# EAGLE board IBL behavior control (EAGLE 6.5.0)
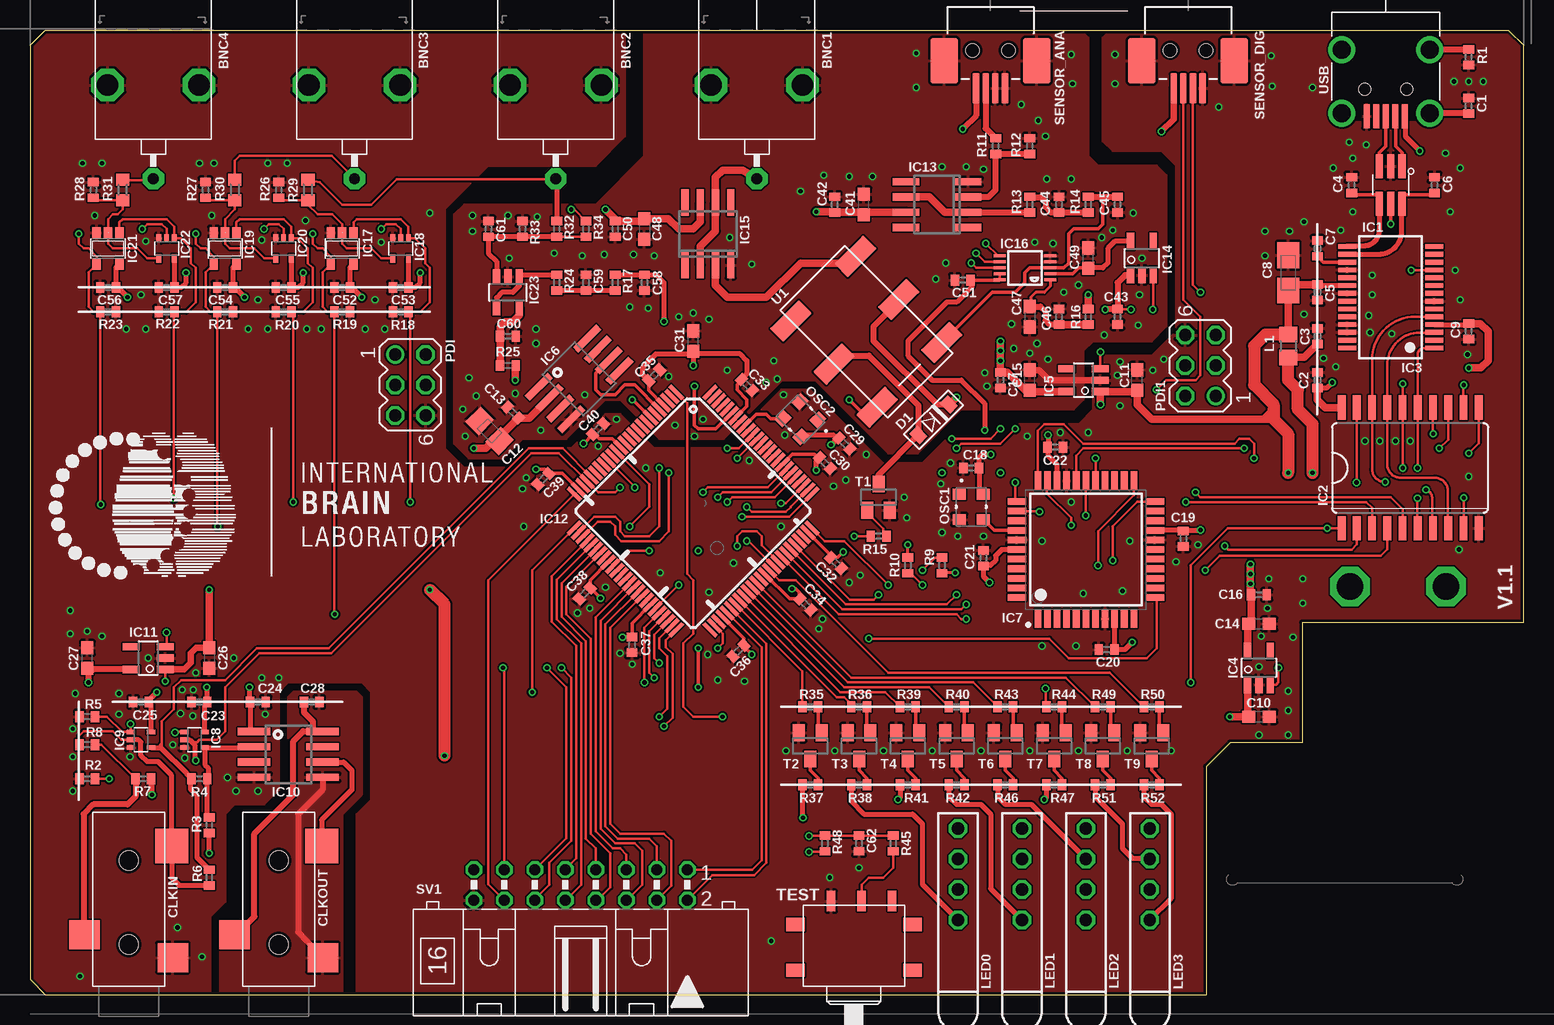
[diagram p2: board, top side]
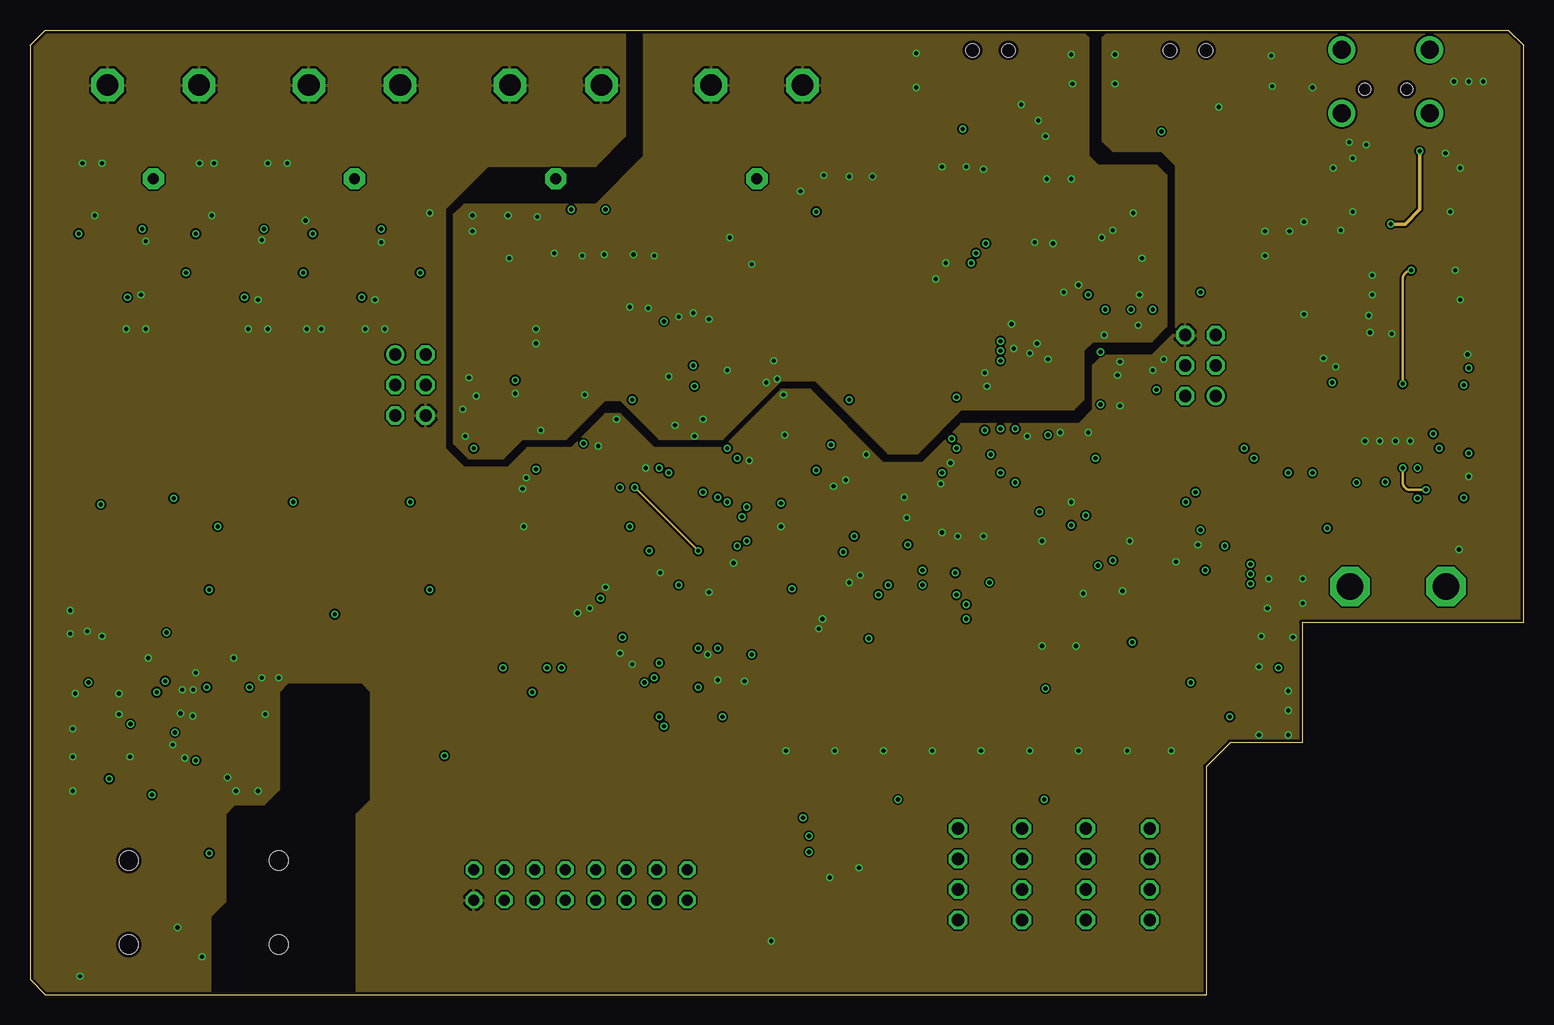
[diagram p3: board, inner layer Ground]
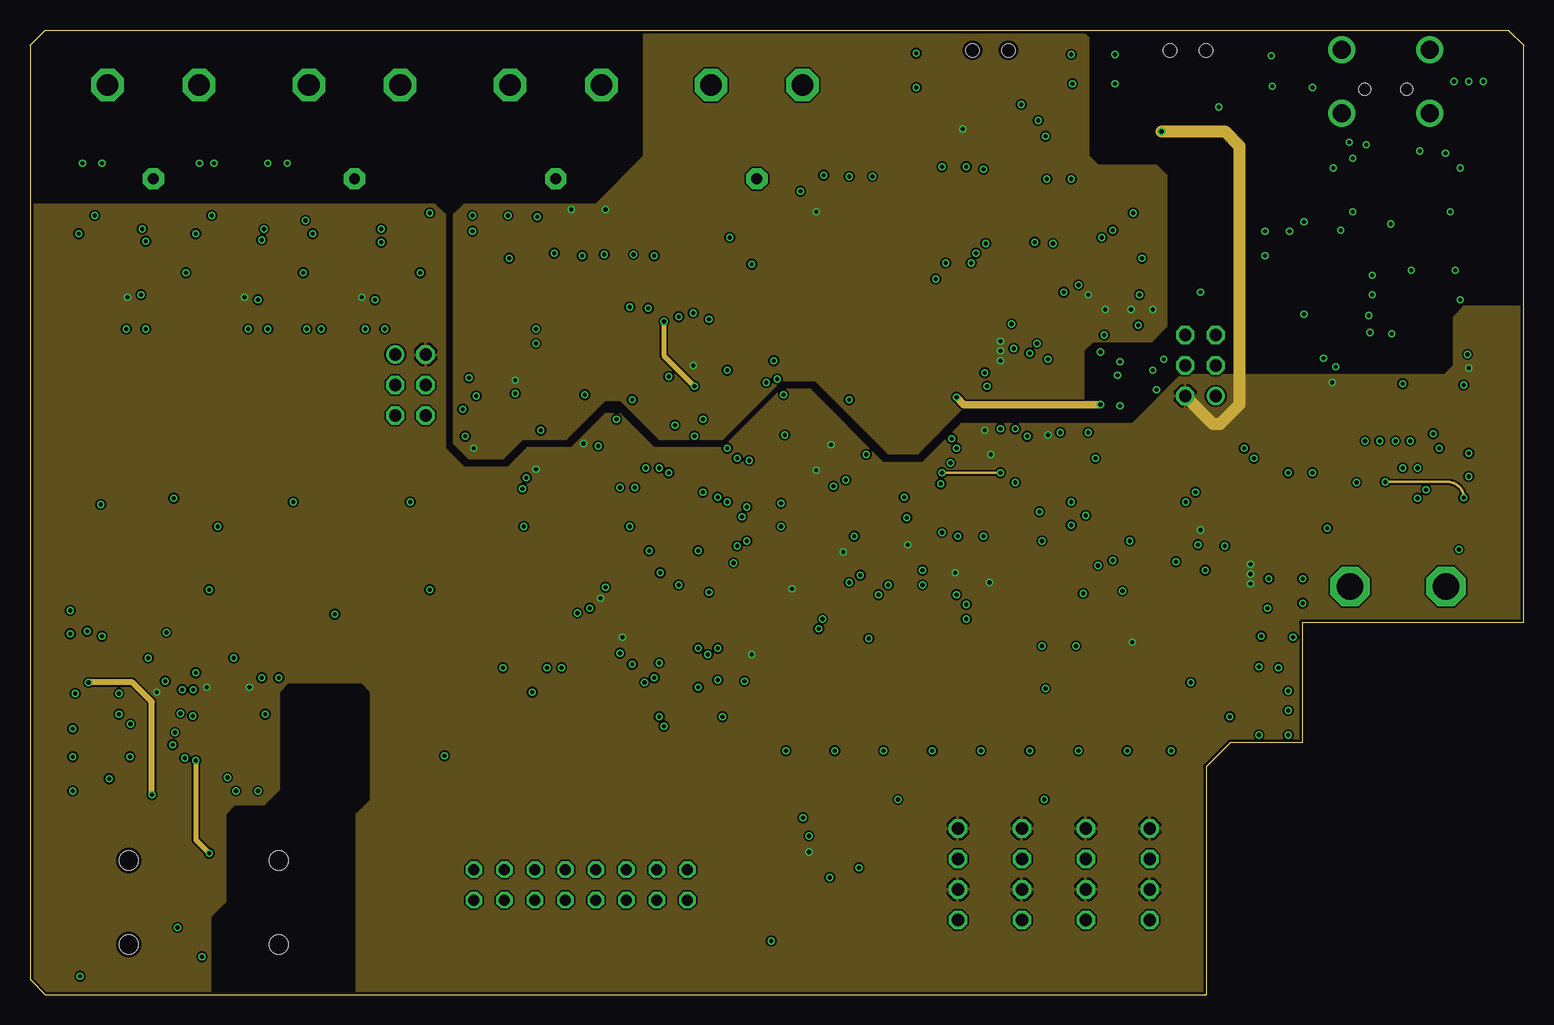
[diagram p4: board, inner layer Power]
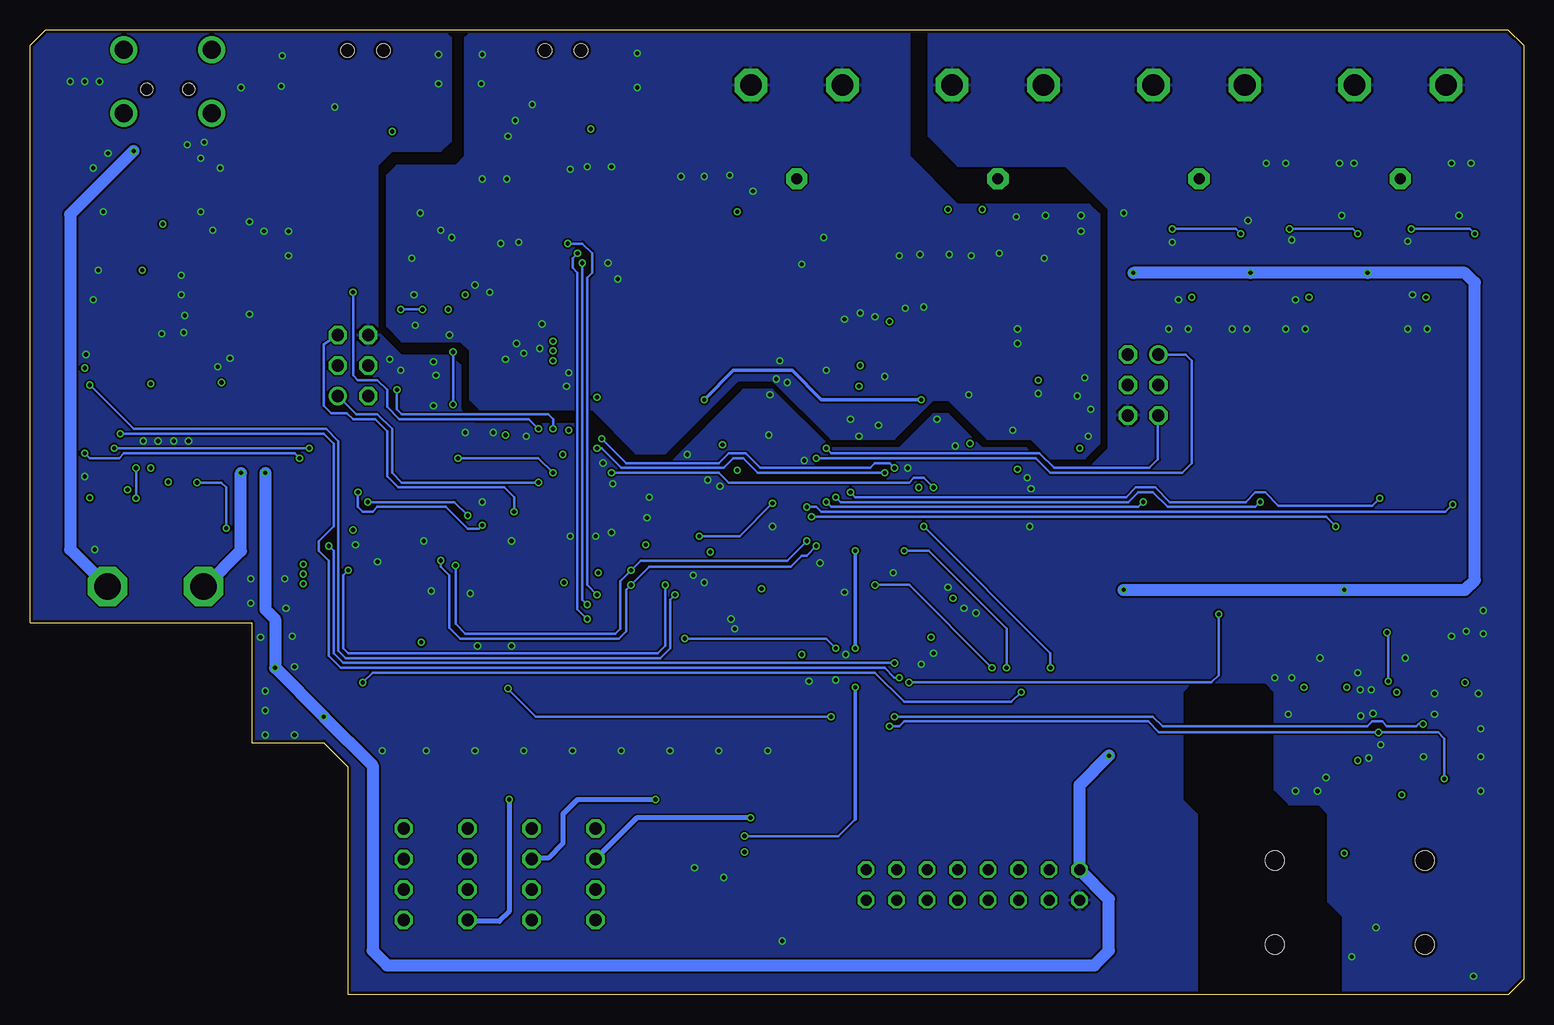
[diagram p5: board, bottom side, seen from below]

Size 124.46 x 80.38 mm. Coordinates in mm from the lower left corner, seen from the top.
Outline: 0,79.11 0,1.27 1.27,0 98,0 98,19 100,21 106,21 106,31 124.46,31 124.46,79.11 123.19,80.38 1.27,80.38 0,79.11
Copper layers (1+2*3+16): Top 0.018mm / dielectric 0.36mm / Ground 0.035mm / dielectric 0.71mm / Power 0.035mm / dielectric 0.36mm / Bottom 0.018mm
Design rules "eC_4Layer_PClass6_BaseCopperO18-I35_eCDefault *": minimum track width 0.15mm, minimum drill 0.35mm, track to track 0.15mm, track to pad 0.15mm, pad to pad 0.15mm, via to via 0.15mm, smd to smd 0mil, copper to edge 0.25mm, drill to drill 0.35mm, minimum pad ring 0.175mm, minimum via ring 0.125mm, stop-mask expansion 0mil, vias tented up to drill 0.45mm, thermal gap 0.2mm
tKeepout: area 0,0.5 to 2.5,80.5; area 122.4,0.5 to 125,80.5
bKeepout: area 122.4,0.5 to 125,80.5

## Footprints (pad centres in the part's own frame; a part is rotated, then mirrored left to right if it is on the bottom)
0731000105 = drill 0.914 pad 1.778 octagon: 1 0,12.395 | drill 1.803 octagon: 2 -3.81,4.597; 3 3.81,4.597
C0402 = smd 0.7 x 0.9: 1 -0.65,0; 2 0.65,0
A/3216-18W = smd 2.15 x 1.8: + 1.475,0; - -1.475,0
C0603 = smd 1.1 x 1: 1 -0.85,0; 2 0.85,0
R/2012-12R = smd 1.55 x 1.8: + 1.175,0; - -1.175,0
35RASMT2BHNTRX = smd 2.4 x 2.55: 1 0.8,3.675; 5 -1.1,-3.675 | smd 2.9 x 2.75: 4 8.2,-3.575 | hole 1.6: 0,0; 7,0
SOD123 = smd 0.914 x 1.219: A -1.8,0; C 1.8,0
SOT23-6L = smd 0.6 x 2: P$1 -0.95,-1.55; P$2 0,-1.55; P$3 0.95,-1.55; P$4 0.95,1.55; P$5 0,1.55; P$6 -0.95,1.55
SO20W = smd 0.66 x 2.032: 1 -5.715,-5.029; 2 -4.445,-5.029; 3 -3.175,-5.029; 4 -1.905,-5.029; 5 -0.635,-5.029; 6 0.635,-5.029; 7 1.905,-5.029; 8 3.175,-5.029; 9 4.445,-5.029; 10 5.715,-5.029; 11 5.715,5.029; 12 4.445,5.029; 13 3.175,5.029; 14 1.905,5.029; 15 0.635,5.029; 16 -0.635,5.029; 17 -1.905,5.029; 18 -3.175,5.029; 19 -4.445,5.029; 20 -5.715,5.029
SSOP28 = smd 0.4 x 1.5: 1 -4.225,-3.625; 2 -3.575,-3.625; 3 -2.925,-3.625; 4 -2.275,-3.625; 5 -1.625,-3.625; 6 -0.975,-3.625; 7 -0.325,-3.625; 8 0.325,-3.625; 9 0.975,-3.625; 10 1.625,-3.625; 11 2.275,-3.625; 12 2.925,-3.625; 13 3.575,-3.625; 14 4.225,-3.625; 15 4.225,3.625; 16 3.575,3.625; 17 2.925,3.625; 18 2.275,3.625; 19 1.625,3.625; 20 0.975,3.625; 21 0.325,3.625; 22 -0.325,3.625; 23 -0.975,3.625; 24 -1.625,3.625; 25 -2.275,3.625; 26 -2.925,3.625; 27 -3.575,3.625; 28 -4.225,3.625
TSOT23-5 = smd 0.6 x 1.408: 1 -0.95,-1.404; 2 0,-1.404; 3 0.95,-1.404; 4 0.95,1.404; 5 -0.95,1.404
SO-08 = smd 0.6 x 2.708: 1 -1.905,-2.854; 2 -0.635,-2.854; 3 0.635,-2.854; 4 1.905,-2.854; 5 1.905,2.854; 6 0.635,2.854; 7 -0.635,2.854; 8 -1.905,2.854
QFP80P1200X1200X120-44N = smd 1.55 x 0.55: 1 -5.75,4; 2 -5.75,3.2; 3 -5.75,2.4; 4 -5.75,1.6; 5 -5.75,0.8; 6 -5.75,0; 7 -5.75,-0.8; 8 -5.75,-1.6; 9 -5.75,-2.4; 10 -5.75,-3.2; 11 -5.75,-4; 23 5.75,-4; 24 5.75,-3.2; 25 5.75,-2.4; 26 5.75,-1.6; 27 5.75,-0.8; 28 5.75,0; 29 5.75,0.8; 30 5.75,1.6; 31 5.75,2.4; 32 5.75,3.2; 33 5.75,4 | smd 0.55 x 1.55: 12 -4,-5.75; 13 -3.2,-5.75; 14 -2.4,-5.75; 15 -1.6,-5.75; 16 -0.8,-5.75; 17 0,-5.75; 18 0.8,-5.75; 19 1.6,-5.75; 20 2.4,-5.75; 21 3.2,-5.75; 22 4,-5.75; 34 4,5.75; 35 3.2,5.75; 36 2.4,5.75; 37 1.6,5.75; 38 0.8,5.75; 39 0,5.75; 40 -0.8,5.75; 41 -1.6,5.75; 42 -2.4,5.75; 43 -3.2,5.75; 44 -4,5.75
SC70-5 = smd 0.4 x 0.7: 1 -0.65,-0.85; 2 0,-0.85; 3 0.65,-0.85; 4 0.65,0.85; 5 -0.65,0.85
TQFP100 = smd 1.5 x 0.35: 1 -8,6; 2 -8,5.5; 3 -8,5; 4 -8,4.5; 5 -8,4; 6 -8,3.5; 7 -8,3; 8 -8,2.5; 9 -8,2; 10 -8,1.5; 11 -8,1; 12 -8,0.5; 13 -8,0; 14 -8,-0.5; 15 -8,-1; 16 -8,-1.5; 17 -8,-2; 18 -8,-2.5; 19 -8,-3; 20 -8,-3.5; 21 -8,-4; 22 -8,-4.5; 23 -8,-5; 24 -8,-5.5; 25 -8,-6; 51 8,-6; 52 8,-5.5; 53 8,-5; 54 8,-4.5; 55 8,-4; 56 8,-3.5; 57 8,-3; 58 8,-2.5; 59 8,-2; 60 8,-1.5; 61 8,-1; 62 8,-0.5; 63 8,0; 64 8,0.5; 65 8,1; 66 8,1.5; 67 8,2; 68 8,2.5; 69 8,3; 70 8,3.5; 71 8,4; 72 8,4.5; 73 8,5; 74 8,5.5; 75 8,6 | smd 0.35 x 1.5: 26 -6,-8; 27 -5.5,-8; 28 -5,-8; 29 -4.5,-8; 30 -4,-8; 31 -3.5,-8; 32 -3,-8; 33 -2.5,-8; 34 -2,-8; 35 -1.5,-8; 36 -1,-8; 37 -0.5,-8; 38 0,-8; 39 0.5,-8; 40 1,-8; 41 1.5,-8; 42 2,-8; 43 2.5,-8; 44 3,-8; 45 3.5,-8; 46 4,-8; 47 4.5,-8; 48 5,-8; 49 5.5,-8; 50 6,-8; 76 6,8; 77 5.5,8; 78 5,8; 79 4.5,8; 80 4,8; 81 3.5,8; 82 3,8; 83 2.5,8; 84 2,8; 85 1.5,8; 86 1,8; 87 0.5,8; 88 0,8; 89 -0.5,8; 90 -1,8; 91 -1.5,8; 92 -2,8; 93 -2.5,8; 94 -3,8; 95 -3.5,8; 96 -4,8; 97 -4.5,8; 98 -5,8; 99 -5.5,8; 100 -6,8
SO8 = smd 0.6 x 2.2: 1 -1.905,-2.6; 2 -0.635,-2.6; 3 0.635,-2.6; 4 1.905,-2.6; 5 1.905,2.6; 6 0.635,2.6; 7 -0.635,2.6; 8 -1.905,2.6
MSOP10 = smd 0.25 x 1: 1 -1,-2.113; 2 -0.5,-2.113; 3 0,-2.113; 4 0.5,-2.113; 5 1,-2.113; 6 1,2.113; 7 0.5,2.113; 8 0,2.113; 9 -0.5,2.113; 10 -1,2.113
SOT23-5 = smd 0.69 x 0.99: 1 -0.95,-1.29; 2 0,-1.29; 3 0.95,-1.29; 4 0.95,1.3; 5 -0.95,1.3
SOT23-5' = smd 0.6 x 1.2: 1 -0.95,-1.306; 2 0,-1.306; 3 0.95,-1.306; 4 0.95,1.306; 5 -0.95,1.306
R0805 = smd 1.3 x 1.5: 1 -0.95,0; 2 0.95,0
569-011X-X00_LED_ARRAY = drill 1.016 octagon: A1 -6.35,0; A2 -1.27,0; C1 -8.89,0; C2 -3.81,0
OSCILLATOR_3.2X2.5 = smd 0.9 x 1.1: P$1 -1.05,-1; P$2 1.05,-1; P$3 1.05,1; P$4 -1.05,1
MA03-2 = drill 1.016: 1 -2.54,-1.27 | drill 1.016 octagon: 2 -2.54,1.27; 3 0,-1.27; 4 0,1.27; 5 2.54,-1.27; 6 2.54,1.27
R0402 = smd 0.7 x 0.9: 1 -0.65,0; 2 0.65,0
R0603 = smd 1 x 1.1: 1 -0.85,0; 2 0.85,0
MQ172X-4PA(31) = smd 0.55 x 2.5: 1 -1.2,6.75; 2 -0.4,6.75; 3 0.4,6.75; 4 1.2,6.75 | smd 2.3 x 3.8: SHIELD1 -3.85,4.45; SHIELD2 3.85,4.45 | hole 1.1: 1.5,3.6; -1.5,3.6
ML16L = drill 0.914 octagon: 1 -8.89,-1.27; 2 -8.89,1.27; 3 -6.35,-1.27; 4 -6.35,1.27; 5 -3.81,-1.27; 6 -3.81,1.27; 7 -1.27,-1.27; 8 -1.27,1.27; 9 1.27,-1.27; 10 1.27,1.27; 11 3.81,-1.27; 12 3.81,1.27; 13 6.35,-1.27; 14 6.35,1.27; 15 8.89,-1.27; 16 8.89,1.27
SOT23 = smd 1 x 1.4: 1 -0.95,-1.1; 2 0.95,-1.1; 3 0,1.1
CFPA = smd 1.7 x 0.7: 1 3.85,1.9; 2 3.85,-0.64; 3 3.85,-3.18 | smd 1.1 x 1.55: NC1 -1.905,4.875; NC2 -1.905,-4.875; NC3 1.905,-4.875; NC4 1.905,4.875
RELAY = smd 1.6 x 3.4: 1 -5.08,-2.54; 3 0,-2.54; 5 5.08,-2.54; 6 5.08,5.08; 8 0,5.08; 10 -5.08,5.08
240-0002-1 = smd 0.5 x 2: P$1 -1.6,8.65; P$2 -0.8,8.65; P$3 0,8.65; P$4 0.8,8.65; P$5 1.6,8.65 | drill 1.5: SHIELD_1 -3.65,3.1; SHIELD_2 3.65,3.1; SHIELD_3 3.65,8.4; SHIELD_4 -3.65,8.4 | hole 1: -1.75,6.4; 1.75,6.4

## Placement (x,y rotation side)
BNC1  [0731000105]  60.57,80.38 180 top
BNC2  [0731000105]  43.81,80.38 180 top
BNC3  [0731000105]  27.04,80.38 180 top
BNC4  [0731000105]  10.28,80.38 180 top
C1  4.7nF  [C0402]  119.89,74.06 90 top
C2  100nF  [C0402]  107.29,51.21 90 top
C3  100nF  [C0402]  107.29,54.86 90 top
C4  47pF  [C0402]  110.13,67.46 90 top
C5  100nF  [C0402]  107.29,58.52 270 top
C6  47pF  [C0402]  117.04,67.46 90 top
C7  100nF  [C0402]  107.29,62.18 90 top
C8  4.7uF  [A/3216-18W]  104.85,60.15 270 top
C9  100nF  [C0402]  119.89,55.27 270 top
C10  4.7uF  [C0603]  102.41,23.16 0 top
C11  10uF  [C0603]  92.25,51.21 90 top
C12  1uF  [R/2012-12R]  38.3,46.98 315 top
C13  100nF  [C0402]  40.24,48.51 135 top
C14  4.7uF  [C0603]  102.41,30.89 0 top
C15  10uF  [C0603]  83.31,51.21 90 top
C16  100nF  [C0402]  102.41,33.32 0 top
C17  100nF  [C0402]  80.87,51.21 270 top
C18  100nF  [C0402]  78.44,43.89 180 top
C19  100nF  [C0402]  96.11,38 270 top
C20  100nF  [C0402]  89.71,28.75 180 top
C21  100nF  [C0402]  79.45,36.37 90 top
C22  100nF  [C0402]  85.45,45.62 0 top
C23  100nF  [C0402]  14.12,24.38 180 top
C24  100nF  [C0402]  19,24.38 0 top
C25  100nF  [C0402]  9.25,24.38 180 top
C26  4.7uF  [C0603]  14.94,28.04 270 top
C27  4.7uF  [C0603]  4.78,28.04 90 top
C28  100nF  [C0402]  23.47,24.38 0 top
C29  100nF  [C0402]  67.87,45.92 315 top
C30  100nF  [C0402]  66.24,44.3 315 top
C31  4.7uF  [C0603]  55.27,54.46 90 top
C32  100nF  [C0402]  67.16,35.97 315 top
C33  100nF  [C0402]  59.74,50.8 315 top
C34  100nF  [C0402]  64.62,32.51 315 top
C35  100nF  [C0402]  52.02,51.61 45 top
C36  100nF  [C0402]  59.03,28.65 225 top
C37  100nF  [C0402]  50.17,29.14 270 top
C38  100nF  [C0402]  46.23,33.43 225 top
C39  100nF  [C0402]  42.77,42.98 225 top
C40  100nF  [C0402]  47.35,47.14 45 top
C41  10uF  [C0603]  69.49,65.84 90 top
C42  100nF  [C0402]  67.06,65.84 90 top
C43  100nF  [C0402]  90.63,56.49 270 top
C44  DNP  [C0402]  85.75,65.84 90 top
C45  DNP  [C0402]  90.63,65.84 270 top
C46  100nF  [C0402]  85.75,56.49 90 top
C47  10uF  [C0603]  83.31,56.49 270 top
C48  10uF  [C0603]  51.21,63.8 270 top
C49  4.7uF  [C0603]  88.19,61.37 90 top
C50  100nF  [C0402]  48.77,63.8 270 top
C51  100nF  [C0402]  77.72,59.54 180 top
C52  100nF  [C0402]  26.01,58.93 180 top
C53  100nF  [C0402]  30.89,58.93 180 top
C54  100nF  [C0402]  16.26,58.93 180 top
C55  100nF  [C0402]  21.13,58.93 180 top
C56  100nF  [C0402]  6.5,58.93 180 top
C57  100nF  [C0402]  11.38,58.93 180 top
C58  DNP  [C0402]  51.21,59.33 90 top
C59  15nF 5%  [C0402]  46.33,59.33 270 top
C60  100nF  [C0402]  39.83,54.86 0 top
C61  DNP  [C0402]  38.2,63.8 270 top
C62  100nF  [C0402]  69.09,12.6 270 top
CLKIN  [35RASMT2BHNTRX]  8.23,4.18 90 top
CLKOUT  [35RASMT2BHNTRX]  20.73,4.18 90 top
D1  1N5819  [SOD123]  75.3,47.91 45 top
IC1  USBLC6-2SC6  [SOT23-6L]  113.39,67.46 180 top
IC2  74AC241DW  [SO20W]  115.01,43.89 0 top
IC3  FT232RL  [SSOP28]  113.39,58.12 90 top
IC4  TLV70033DDCR  [TSOT23-5]  102.41,27.23 0 top
IC5  LP5907MFX-3.3  [TSOT23-5]  87.78,51.21 90 top
IC6  MAX616x  [SO-08]  45.76,51.31 315 top
IC7  ATXMEGAxxxA4U-AU  [QFP80P1200X1200X120-44N]  87.99,37.08 90 top
IC8  [SC70-5]  13.72,21.23 270 top
IC9  [SC70-5]  9.25,21.23 270 top
IC10  SI8610BC-B-IS  [SO-08]  21.54,20.02 270 top
IC11  TLV70033DDCR  [TSOT23-5]  9.86,28.04 90 top
IC12  XMEGA-A1TQFP  [TQFP100]  55.26,40.29 315 top
IC13  AD8655ARZ  [SO8]  75.59,65.84 90 top
IC14  TCR2EF18LMCT  [TSOT23-5]  92.66,61.37 0 top
IC15  AD8655ARZ  [SO8]  56.49,63.4 0 top
IC16  MCP33151  [MSOP10]  82.91,60.55 90 top
IC17  [SOT23-5]  26.01,62.18 180 top
IC18  [SC70-5]  30.89,62.18 180 top
IC19  [SOT23-5]  16.26,62.18 180 top
IC20  [SC70-5]  21.13,62.18 180 top
IC21  [SOT23-5]  6.5,62.18 180 top
IC22  [SC70-5]  11.38,62.18 180 top
IC23  OPA365  [SOT23-5']  39.83,58.52 180 top
L1  ???  [R0805]  104.85,54.05 270 top
LED0  569-0112-100  [569-011X-X00_LED_ARRAY]  77.33,15.11 90 top
LED1  569-0112-100  [569-011X-X00_LED_ARRAY]  82.66,15.11 90 top
LED2  569-0112-100  [569-011X-X00_LED_ARRAY]  87.99,15.11 90 top
LED3  569-0112-100  [569-011X-X00_LED_ARRAY]  93.32,15.11 90 top
OSC1  [OSCILLATOR_3.2X2.5]  78.44,40.64 270 top
OSC2  [OSCILLATOR_3.2X2.5]  64.21,47.96 135 top
PDI  [MA03-2]  31.7,50.8 270 top
PDI1  [MA03-2]  97.54,52.43 90 top
R1  1M  [R0402]  119.89,78.12 270 top
R2  100k  [R0402]  4.78,17.98 0 top
R3  DNP  [R0402]  14.94,14.12 90 top
R4  0  [R0402]  14.12,17.98 0 top
R5  100k  [R0402]  4.78,23.16 0 top
R6  DNP  [R0402]  14.94,9.75 270 top
R7  10  [R0402]  9.45,17.98 180 top
R8  100k  [R0402]  4.78,20.83 180 top
R9  100k  [R0402]  76,35.76 90 top
R10  100k  [R0402]  73.15,35.76 270 top
R11  10  [R0402]  80.47,70.71 90 top
R12  DNP  [R0402]  83.31,70.71 90 top
R13  10  [R0402]  83.31,65.84 270 top
R14  0  [R0402]  88.19,65.84 270 top
R15  1k  [R0402]  70.71,38.2 0 top
R16  10  [R0402]  88.19,56.49 90 top
R17  0  [R0402]  48.77,59.33 90 top
R18  100k  [R0402]  30.89,56.9 0 top
R19  100k  [R0402]  26.01,56.9 180 top
R20  100k  [R0402]  21.13,56.9 0 top
R21  100k  [R0402]  16.26,56.9 180 top
R22  100k  [R0402]  11.38,56.9 0 top
R23  100k  [R0402]  6.5,56.9 180 top
R24  10k 1%  [R0402]  43.89,59.33 270 top
R25  10  [R0402]  39.83,52.43 0 top
R26  100k  [R0402]  20.73,67.06 90 top
R27  100k  [R0402]  14.63,67.06 90 top
R28  100k  [R0402]  5.28,67.06 90 top
R29  100 0.25W  [R0603]  23.16,67.06 90 top
R30  100 0.25W  [R0603]  17.07,67.06 90 top
R31  100 0.25W  [R0603]  7.72,67.06 90 top
R32  24k  [R0402]  43.89,63.8 90 top
R33  16k  [R0402]  41.05,63.8 270 top
R34  DNP  [R0402]  46.33,63.8 270 top
R35  1k  [R0402]  65.02,23.98 0 top
R36  1k  [R0402]  69.09,23.98 0 top
R37  270  [R0402]  65.02,17.48 0 top
R38  270  [R0402]  69.09,17.48 0 top
R39  1k  [R0402]  73.15,23.98 0 top
R40  1k  [R0402]  77.22,23.98 0 top
R41  270  [R0402]  73.15,17.48 0 top
R42  270  [R0402]  77.22,17.48 0 top
R43  1k  [R0402]  81.28,23.98 0 top
R44  1k  [R0402]  85.34,23.98 0 top
R45  10k  [R0402]  71.93,12.6 90 top
R46  270  [R0402]  81.28,17.48 0 top
R47  270  [R0402]  85.34,17.48 0 top
R48  100k  [R0402]  66.24,12.6 270 top
R49  1k  [R0402]  89.41,23.98 0 top
R50  1k  [R0402]  93.47,23.98 0 top
R51  270  [R0402]  89.41,17.48 0 top
R52  270  [R0402]  93.47,17.48 0 top
SENSOR_ANA  MQ172X-4PA(31)  [MQ172X-4PA(31)]  80.04,82.29 180 top
SENSOR_DIG  MQ172X-4PA(31)  [MQ172X-4PA(31)]  96.51,82.28 180 top
SV1  [ML16L]  45.89,9.14 180 top
T1  BC850  [SOT23]  70.71,41.45 0 top
T2  BC850  [SOT23]  65.02,20.73 180 top
T3  BC850  [SOT23]  69.09,20.73 180 top
T4  BC850  [SOT23]  73.15,20.73 180 top
T5  BC850  [SOT23]  77.22,20.73 180 top
T6  BC850  [SOT23]  81.28,20.73 180 top
T7  BC850  [SOT23]  85.34,20.73 180 top
T8  BC850  [SOT23]  89.41,20.73 180 top
T9  BC850  [SOT23]  93.47,20.73 180 top
TEST  CFPA  [CFPA]  68.66,3.94 90 top
U1  DK: PB285CT-ND  [RELAY]  70.59,56.13 135 top
USB  [240-0002-1]  112.98,81.85 180 top

## Tracks (layer width: path | path; a pad name or v marks a point on that pad's centre or on a via)
5VSWITCH  (via drill 0.35, 2.2)
  Top 0.61: C3.1 106.18,53.1 L1.2
  Top 1.016: v106.88,43.48 106.88,47.55 105.66,48.77 105.66,50.39 104.85,51.21 L1.2
  Bottom 1.016: v110,34 109.87,34 106.88,36.98 v106.88,43.48
5VUSB  (via drill 0.35, 2.2)
  Top 0.305: IC1.P$5 v113.39,64.21
  Top 0.406: USB.P$1 114.61,72.67 114.61,71.53 v115.82,70.31
  Ground 0.305: v113.39,64.21 114.61,64.21 115.82,65.43 v115.82,70.31
  Bottom 1.016: v115.82,70.31 121.11,65.02 121.11,37.11 v118,34
!EN_MASTER  (via drill 0.35)
  Top 0.203: v96.72,26.01 96.72,35.76 99.82,38.86 v108.1,38.86 IC2.1 | v41.86,25.2 41.86,35.37 IC12.26 | IC2.19 110.57,42.7 v110.54,42.67
  Bottom 0.203: v96.72,26.01 95.91,26.82 54.05,26.82 51.61,24.38 42.67,24.38 v41.86,25.2 | v110.54,42.67 108.51,42.67 108.1,42.27 v108.1,38.86
+5V  (via drill 0.35)
  Top 0.203: 89.19,49.19 v89.2,49.17 | v89.2,53.54 89.2,52.17 IC5.3 | IC4.3 103.85,25.82 104.04,26.01 v104.04,27.23 | IC11.1 11.26,26.23 v11.28,26.11 | v11.38,30.18 11.38,28.99 IC11.3
  Top 0.406: IC3.20 107.29,59.09 C5.1 | 105.35,59.17 C8.+ | v13.01,60.15 13.01,59.33 12.6,58.93 C57.1 IC22.5 | v22.76,60.15 22.76,59.33 22.35,58.93 C55.1 IC20.5 | v32.51,60.15 32.51,59.33 32.11,58.93 C53.1 IC18.5
  Top 0.508: 76.4,49.35 D1.C 75.59,49.18 70.31,54.46 70.31,55.68 72.39,57.76 U1.3
  Top 0.559: C26.1 13.86,28.89 13.41,28.45 13.41,27.64 12.87,27.09 IC11.1
  Top 0.61: C5.1 105.35,59.17 | L1.1 C8.+ | C26.1 v14.94,33.73 | 102.82,47.95 93.47,47.95 92.25,49.17 C11.1 92.15,50.26 IC5.1 89.19,49.19 | 102.82,47.95 103.63,47.95 | 102.82,47.95 103.63,48.77 | IC4.1 101.46,23.27 C10.1 v99.97,23.16 | D1.C 76.61,49.18 v77.22,49.78
  Top 1.016: L1.1 102.96,55 102.01,54.05 102.01,50.8 103.63,49.17 103.63,48.77 103.63,47.95 104.85,46.74 v104.85,43.48 | v34.54,19.91 34.54,32.51 v33.33,33.73
  Power 0.61: v77.22,49.78 77.83,49.17 v89.2,49.17
  Bottom 0.203: v89.2,49.17 v89.2,53.54 | v11.28,26.11 11.28,30.07 v11.38,30.18
  Bottom 1.016: v104.85,43.48 104.85,32.11 104.04,31.29 v104.04,27.23 v99.97,23.16 95.91,19.1 95.91,3.66 94.69,2.44 35.76,2.44 34.54,3.66 34.54,7.96 SV1.15 37,17.46 v34.54,19.91 | v33.33,33.73 v14.94,33.73 4.88,33.73 4.06,34.54 4.06,59.33 4.88,60.15 v13.01,60.15 v22.76,60.15 v32.51,60.15
ADC0  (via drill 0.35)
  Top 0.305: IC12.95 57.16,47.14 55.68,47.14 55.37,47.45 v55.37,50.7
  Top 0.406: R17.2 C58.2 52.18,59.98 52.83,59.33 v52.83,56.08
  Power 0.406: v55.37,50.7 52.83,53.24 v52.83,56.08
ADC_CNVST  (via drill 0.35)
  Top 0.203: IC16.6 80.69,61.55 v79.65,62.59 | v77.22,33.33 76.4,32.51 68,32.51 IC12.70
  Bottom 0.203: v79.65,62.59 78.44,62.59 77.62,61.77 77.62,60.15 78.03,59.74 78.03,34.14 v77.22,33.33
ADC_SCLK  (via drill 0.35)
  Top 0.203: IC16.8 78.84,60.55 v78.44,60.96 | v78.03,32.51 77.62,32.11 67.69,32.11 IC12.69
  Bottom 0.203: v78.44,60.96 78.44,32.92 v78.03,32.51
ADC_SDO  (via drill 0.35)
  Top 0.203: IC16.7 79.56,61.05 v78.84,61.77 | v78.03,31.29 77.62,31.29 77.22,31.7 67.39,31.7 IC12.68
  Bottom 0.203: v78.84,61.77 79.25,61.37 79.25,60.55 78.84,60.15 78.84,32.11 v78.03,31.29
CLK_CTS  (via drill 0.35)
  Top 0.203: IC2.13 118.19,46.25 v117.45,45.52 | v101.19,45.52 87.78,45.52 87.19,44.92 IC7.29
  Bottom 0.203: v117.45,45.52 v101.19,45.52
CLK_RTS  (via drill 0.35)
  Top 0.203: IC2.3 111.84,40.56 111.35,41.05 v96.32,41.05 | v87.99,39.93 IC7.28
  Bottom 0.203: v96.32,41.05 89.1,41.05 v87.99,39.93
CLK_RXD  (via drill 0.35)
  Top 0.203: IC2.11 120.73,45.95 v119.89,45.11 | v102.01,44.7 102.01,45.92 101.6,46.33 100.79,46.33 100.38,45.92 87.78,45.92 86.16,47.55 84.53,47.55 83.99,47 IC7.33
  Bottom 0.203: v119.89,45.11 119.48,44.7 117.04,44.7 116.64,45.11 102.41,45.11 v102.01,44.7
CLK_TXD  (via drill 0.35)
  Top 0.203: IC2.5 114.38,40.46 113.39,41.45 97.54,41.45 v97.13,41.86 | v86.77,39.12 86.77,39.73 84.73,41.76 84.73,42.78 IC7.32
  Bottom 0.203: v97.13,41.86 97.13,40.64 96.72,40.23 95.91,40.23 95.5,40.64 89.81,40.64 87.99,38.81 87.07,38.81 v86.77,39.12
CLOCK_IN_EN  (via drill 0.35)
  Top 0.203: R5.2 6.4,23.16 7.68,21.88 IC9.1 8.38,21.9 v8.38,22.55 | v52.43,23.16 53.09,23.82 53.09,28.19 52.43,28.85 52.43,29.68 IC12.49
  Bottom 0.203: v8.38,22.55 8.74,22.55 8.94,22.35 11.38,22.35 11.79,22.76 12.6,22.76 13.01,22.35 30.07,22.35 30.89,23.16 v52.43,23.16
CLOCK_OUT  (via drill 0.35)
  Top 0.203: 13.72,20.83 13.92,21.03 | 13.92,21.03 14.12,21.23 15.54,21.23 16.26,21.95 16.26,25.6 19.1,28.45 25.09,28.45 41.76,45.11 44.08,45.11 IC12.22 47.33,41.86 48.77,41.86 v49.17,42.27 | v88.8,44.7 88.8,42.85 IC7.27 | 13.92,21.03 13.61,21.03
  Top 0.406: IC8.2 13.31,21.23 13.72,20.83 13.72,19.61 v13.82,19.51 | v14.94,11.79 R3.1
  Power 0.203: v76,43.48 v80.87,43.48
  Power 0.406: v13.82,19.51 13.82,12.9 v14.94,11.79
  Bottom 0.203: v76,43.48 67.06,43.48 66.24,42.67 51.21,42.67 50.8,43.08 49.99,43.08 v49.17,42.27 | v80.87,43.48 82.09,44.7 v88.8,44.7
CLOCK_OUT_EN  (via drill 0.35)
  Top 0.203: R2.2 v6.6,17.98 | 12.83,21.84 IC8.1 12.13,21.88 v12.09,21.84 | IC12.50 52.98,29.53 52.98,28.96 53.54,28.4 53.54,23.06 v52.83,22.35
  Bottom 0.203: v6.6,17.98 6.6,21.34 7.11,21.84 v12.09,21.84 30.38,21.84 31.29,22.76 51.61,22.76 52.02,22.35 v52.83,22.35
CLOCK_SET  (via drill 0.35)
  Top 0.203: IC12.52 57.71,30.07 57.71,29.26 v57.3,28.85 | v69.9,29.67 84.94,29.67 86.56,28.04 93.07,28.04 93.88,28.85 93.88,32.94 IC7.12
  Bottom 0.203: v57.3,28.85 58.12,29.67 v69.9,29.67
CLOCK_SYS
  Top 0.203: IC12.21 44.38,45.52 41.55,45.52 24.89,28.85 18.9,28.85 16.26,26.21 12.6,26.21 11.99,25.6 11.99,23.77 10.97,22.76 10.97,20.93 | 10.97,20.93 10.97,20.65 10.91,20.58 | 10.97,20.93 10.67,20.62
  Top 0.406: R6.1 13.92,11.42 13.92,16.56 13.41,17.07 13.41,17.92 R4.1 13.01,18.45 13.01,18.49 10.91,20.58 IC9.4
COM_FROM_USB  (via drill 0.35)
  Top 0.203: IC7.23 91.99,41.59 89,38.61 v89,35.76 | v59.74,37.8 59.88,37.8 IC12.66 | R9.2 75.43,36.41 v74.37,35.36
  Bottom 0.203: v89,35.76 89,30.89 88.19,30.07 75.69,30.07 75.29,30.48 75.29,34.44 v74.37,35.36 73.56,36.17 61.37,36.17 v59.74,37.8
DAC0  (via drill 0.35)
  Top 0.305: IC12.7 50.22,49.58 v50.19,49.58 | v68.28,49.58 69.49,48.36 70.31,48.36 70.59,48.65 U1.10
  Bottom 0.305: v50.19,49.58 58.52,49.58 60.96,52.02 65.84,52.02 v68.28,49.58
DIG_RX  (via drill 0.35)
  Top 0.203: SENSOR_DIG.3 96.11,57.92 97.54,56.49 97.54,51.61 97.13,51.21 94.69,51.21 v93.88,50.39 | v80.87,47.14 80.06,46.33 v76.81,46.33 | v52.43,43.89 52.43,39.01 51.61,38.2 49.58,38.2 49.17,38.61 49.17,39.42 48.77,39.83 47.02,39.83 IC12.27
  Bottom 0.203: v93.88,50.39 93.88,48.77 93.47,48.36 81.28,48.36 80.87,47.95 v80.87,47.14 | v76.81,46.33 74.78,44.3 67.06,44.3 66.24,45.11 64.82,45.11 63.6,43.89 54.46,43.89 54.05,44.3 52.83,44.3 v52.43,43.89
DIG_TX  (via drill 0.35)
  Top 0.203: SENSOR_DIG.2 96.91,59.15 v97.54,58.52 | v82.09,47.14 80.87,45.92 77.62,45.92 v77.22,45.52 | v53.24,43.48 53.24,38.61 52.43,37.8 49.28,37.8 48.77,38.3 48.77,39.01 48.36,39.42 47.32,39.42 IC12.28
  Bottom 0.203: v97.54,58.52 97.54,51.61 97.13,51.21 95.5,51.21 94.69,50.39 94.69,48.97 93.67,47.95 82.91,47.95 v82.09,47.14 | v77.22,45.52 76.81,45.52 75.18,43.89 66.65,43.89 65.84,44.7 65.02,44.7 63.8,43.48 v53.24,43.48
EXT_IO0  (via drill 0.35)
  Top 0.203: SV1.13 39.54,27.11 v39.42,27.23 | v49.99,39.01 51.61,40.64 51.61,42.53 IC12.15
  Bottom 0.203: v39.42,27.23 39.42,28.45 v49.99,39.01
EXT_IO1
  Top 0.203: SV1.14 38.2,9.21 38.2,34.54 IC12.25
EXT_IO2  (via drill 0.35)
  Top 0.203: SV1.11 44.7,13.04 44.7,25.6 v43.08,27.23 | IC12.35 49.83,36.98 v51.61,36.98
  Bottom 0.203: v43.08,27.23 43.08,30.48 49.58,36.98 v51.61,36.98
EXT_IO3  (via drill 0.35)
  Top 0.203: SV1.12 42.08,7.94 43.28,9.14 43.28,10.97 45.11,12.8 45.11,26.42 v44.3,27.23 | v54.05,34.14 IC12.45
  Bottom 0.203: v44.3,27.23 51.21,34.14 v54.05,34.14
EXT_IO4
  Top 0.203: SV1.9 44.62,10.48 45.52,11.38 45.52,29.06 43.48,31.09 43.48,34.88 IC12.29
EXT_IO5
  Top 0.203: SV1.10 44.65,7.87 45.92,9.14 45.92,29.26 43.89,31.29 43.89,34.58 IC12.30
EXT_IO6
  Top 0.203: SV1.7 47.16,12.18 46.33,13.01 46.33,29.46 44.3,31.5 44.3,34.28 IC12.31
EXT_IO7
  Top 0.203: SV1.8 47.29,7.87 48.36,8.94 48.36,11.79 46.74,13.41 46.74,29.67 44.7,31.7 44.7,33.98 IC12.32
EXT_IO8
  Top 0.203: SV1.5 49.7,11.67 49.17,12.19 48.56,12.19 47.14,13.61 47.14,31.46 IC12.39
EXT_IO9
  Top 0.203: SV1.6 49.73,7.87 51,9.14 51,11.99 50.39,12.6 48.77,12.6 47.55,13.82 47.55,31.16 IC12.40
EXT_IO10
  Top 0.203: SV1.3 52.24,12.38 51.61,13.01 48.97,13.01 47.95,14.02 47.95,30.86 IC12.41
EXT_IO11
  Top 0.203: IC12.42 48.36,30.56 48.36,14.22 49.17,13.41 52.83,13.41 53.44,12.8 53.44,9.07 SV1.4
EXT_IO12
  Top 0.203: IC12.55 60.96,28.94 60.96,11.18 60.19,10.41 SV1.1
EXT_IO13
  Top 0.203: IC12.56 61.37,29.24 61.37,10.97 60.35,9.96 56.86,9.96 SV1.2
FTDI_CTS  (via drill 0.35)
  Top 0.203: IC3.11 arc-90 116.97,60.35 v115.11,60.35 | v114.4,50.9 arc90 114.38,50.88 IC2.16 arc-90 114.4,48.9 v114.4,43.89 | 116.89,38.89 IC2.7 arc-90 116.84,38.94 116.84,41.4 arc90 116.18,42.06 v116.33,42.06
  Ground 0.203: v114.4,50.9 114.4,59.64 arc-90 v115.11,60.35 | v114.4,43.89 114.4,42.67 arc90 115.01,42.06 v116.33,42.06
FTDI_RTS
  Top 0.203: IC3.3 arc-90 116.99,55.17 115.82,55.17 arc90 113.11,52.45 IC2.17 113.11,44.17 arc90 114.2,43.08 117.04,43.08 arc-90 118.16,41.96 118.16,38.89 arc90 IC2.8
FTDI_RXD  (via drill 0.35)
  Top 0.203: IC3.5 arc-90 IC3.5 115.42,56.49 arc90 111.84,52.91 IC2.18 111.84,43.81 arc90 v112.93,42.72 | v119.48,41.4 119.48,38.89 arc-90 IC2.9
  Power 0.203: v112.93,42.72 118.16,42.72 arc-90 v119.48,41.4
FTDI_TXD  (via drill 0.35)
  Top 0.203: IC3.1 arc-90 116.97,53.85 116.13,53.85 arc90 115.65,53.37 IC2.15 115.65,43.92 arc-90 v115.62,43.89 | v115.62,41.35 115.62,38.89 arc90 IC2.6
  Bottom 0.203: v115.62,43.89 v115.62,41.35
GND  (via drill 0.35)
  Top 0.559: IC5.2 84.94,51.21 84.12,52.02 83.35,52.02 C15.2
  other vias: 13.56,23.22 13.61,25.4 12.7,25.4 12.55,23.42 49.17,28.45 50.19,27.53 45.62,31.8 46.63,32.21 47.96,33.93 52.53,35.15 8.33,19.81 3.56,19.81 3.56,22.15 3.56,16.97 3.35,30.07 4.78,30.28 5.99,29.87 9.86,28.04 13.82,26.82 16.97,28.04 16.46,18.08 17.17,16.97 19,16.97 11.89,20.83 12.9,19.71 19.61,23.37 19.3,26.42 20.73,26.42 12.29,5.59 14.33,3.15 4.17,1.52 3.76,25.1 3.35,32 7.42,25.1 7.42,23.37 67.06,20.32 62.99,20.32 71.12,20.32 75.18,20.32 79.25,20.32 83.31,20.32 87.38,20.32 91.44,20.32 95.1,20.32 61.77,4.47 66.65,9.75 69.09,10.57 41.35,43.08 41.05,42.16 41.15,39.01 48.87,47.96 53.24,51.51 58.12,52.02 61.37,51 54.05,56.49 55.27,56.79 56.59,56.29 42.57,47.04 46.23,49.99 36.27,46.53 36.07,48.77 37.19,49.89 36.58,51.41 40.44,50.09 66.95,42.37 67.97,42.88 69.7,45.01 62.79,49.99 66.04,31.29 65.74,30.48 69.19,34.95 68.28,34.34 56.49,28.35 59.54,26.11 57.3,26.21 79.45,38.2 77.32,38.2 87.17,29.06 84.33,29.06 95.5,36.07 97.33,37.49 85.85,46.84 88.19,46.84 83.11,46.53 75.9,42.57 76,38.51 84.33,37.8 86.77,41.05 91.64,37.8 87.78,33.43 91.03,33.63 56.59,33.53 58.62,35.97 51.31,43.89 53.75,47.45 62.59,39.01 56.08,47.96 59.94,44.5 62.89,46.63 102.41,21.64 104.85,21.64 104.85,23.67 104.85,25.3 102.41,27.33 103.23,34.65 103.12,32.21 106.07,34.65 106.07,32.61 105.26,29.77 102.62,29.87 119.08,37.08 119.89,43.18 107.8,53.04 108.81,52.32 106.17,56.69 111.56,56.59 111.66,55.17 102.92,61.57 102.92,63.6 104.95,63.6 109.22,63.7 106.17,64.41 111.86,59.94 111.86,58.32 119.18,57.91 118.77,60.35 119.79,53.34 108.61,68.88 110.24,69.7 119.18,68.88 117.96,70.1 118.36,65.23 110.24,65.23 118.67,76.09 119.89,76.09 121.11,76.09 111.35,70.82 109.93,71.02 106.88,75.59 103.43,78.23 103.53,75.69 90.42,78.33 90.42,75.9 99.06,73.96 86.87,75.9 86.77,78.33 73.86,78.44 73.86,75.59 82.6,74.17 84.63,71.53 84.02,72.85 76,68.99 78.03,68.99 79.45,68.78 70.21,68.17 68.28,68.17 66.14,68.28 64.21,66.95 84.73,67.97 86.77,67.97 90.22,63.7 91.95,65.13 85.24,62.59 83.72,62.69 89.31,63.09 92.66,61.37 92.46,58.32 86.16,58.52 87.38,59.13 83.92,54.25 81.79,55.88 92.35,55.78 89.51,54.97 79.76,50.7 79.55,51.82 84.84,52.93 83.31,53.44 81.99,53.85 93.57,52.02 90.83,52.73 90.63,51.61 94.49,52.93 90.83,49.07 72.85,41.45 73.05,39.73 76.71,44.3 76.3,60.96 75.49,59.64 60.15,60.86 58.32,63.09 52.02,61.57 50.29,61.67 47.85,61.67 51.51,57.2 49.99,57.3 46.02,61.57 43.69,61.77 42.27,64.82 39.83,64.92 36.88,64.92 36.88,63.6 39.93,61.37 42.16,55.47 42.16,54.25 4.37,69.29 5.99,69.29 14.12,69.29 15.34,69.29 19.81,69.29 21.44,69.29 8.03,55.47 9.65,55.47 18.19,55.47 19.81,55.47 23.06,55.47 24.28,55.47 27.94,55.47 29.57,55.47 9.25,58.32 19,57.91 28.75,57.91 5.38,64.92 9.65,62.79 15.14,64.92 19.3,62.89 22.96,64.52 29.26,62.69 33.32,65.13 62.28,51.31 61.98,52.83 55.37,46.53 47.35,45.72 113.49,55.07 113.79,46.13 112.47,46.13 111.25,46.13 115.01,46.13
  pour Ground: 87.78,49.58 86.97,48.77 77.62,48.77 73.96,45.11 71.53,45.11 65.43,51.21 62.59,51.21 57.71,46.33 52.43,46.33 49.17,49.58 47.96,49.58 44.7,46.33 41.05,46.33 39.42,44.7 36.58,44.7 35.36,45.92 35.36,65.02 36.17,65.84 47.14,65.84 51.21,69.9 51.21,80.56 87.38,80.56 88.19,79.75 88.19,69.9 89,69.09 93.88,69.09 94.69,68.28 94.69,55.68 93.47,54.46 88.6,54.46 87.78,53.64
  pour Ground: 126.39,-1.63 126.39,80.56 90.22,80.56 89.41,79.75 89.41,71.12 90.22,70.31 94.28,70.31 95.5,69.09 95.5,55.27 93.47,53.24 89.41,53.24 88.6,52.43 88.6,48.77 87.38,47.55 77.62,47.55 74.37,44.3 71.12,44.3 65.02,50.39 62.59,50.39 57.71,45.52 52.02,45.52 49.17,48.36 47.96,48.36 45.11,45.52 41.45,45.52 39.83,43.89 36.17,43.89 34.54,45.52 34.54,65.43 38.2,69.09 47.14,69.09 49.58,71.53 49.58,80.56 -1.63,80.56 -2.03,65.84 -2.03,-1.63 13.82,-1.63 15.04,-0.41 15.04,6.5 16.26,7.72 16.26,15.04 17.07,15.85 19.51,15.85 20.73,17.07 20.73,25.2 21.54,26.01 27.64,26.01 28.45,25.2 28.45,16.26 27.23,15.04 27.23,-0.41 28.45,-1.63
  pour Bottom: 126.39,-1.63 126.39,80.56 90.22,80.56 89.41,79.75 89.41,71.12 90.22,70.31 94.28,70.31 95.5,69.09 95.5,55.27 93.47,53.24 89.41,53.24 88.6,52.43 88.6,48.77 87.38,47.55 77.62,47.55 74.37,44.3 71.12,44.3 65.02,50.39 62.59,50.39 57.71,45.52 52.02,45.52 49.17,48.36 47.96,48.36 45.11,45.52 41.45,45.52 39.83,43.89 36.17,43.89 34.54,45.52 34.54,65.43 38.2,69.09 47.14,69.09 49.58,71.53 49.58,80.56 -1.63,80.56 -2.03,65.84 -2.03,-1.63 13.82,-1.63 15.04,-0.41 15.04,6.5 16.26,7.72 16.26,15.04 17.07,15.85 19.51,15.85 20.73,17.07 20.73,25.2 21.54,26.01 27.64,26.01 28.45,25.2 28.45,16.26 27.23,15.04 27.23,-0.41 28.45,-1.63
  pour Bottom: 87.78,49.58 86.97,48.77 77.62,48.77 73.96,45.11 71.53,45.11 65.43,51.21 62.59,51.21 57.71,46.33 52.43,46.33 49.17,49.58 47.96,49.58 44.7,46.33 41.05,46.33 39.42,44.7 36.58,44.7 35.36,45.92 35.36,65.02 36.17,65.84 47.14,65.84 51.21,69.9 51.21,80.56 87.38,80.56 88.19,79.75 88.19,69.9 89,69.09 93.88,69.09 94.69,68.28 94.69,55.68 93.47,54.46 88.6,54.46 87.78,53.64
  pour Top: 87.78,49.58 86.97,48.77 77.62,48.77 73.96,45.11 71.53,45.11 65.43,51.21 62.69,51.21 57.81,46.33 52.43,46.33 49.17,49.58 47.96,49.58 44.7,46.33 41.05,46.33 39.42,44.7 36.58,44.7 35.36,45.92 35.36,65.02 36.17,65.84 47.14,65.84 51.21,69.9 51.21,80.56 87.38,80.56 88.19,79.75 88.19,69.9 89,69.09 93.88,69.09 94.69,68.28 94.69,55.68 93.47,54.46 88.6,54.46 87.78,53.64
  pour Top: 126.39,-1.63 126.39,80.56 90.22,80.56 89.41,79.75 89.41,71.12 90.22,70.31 94.28,70.31 95.5,69.09 95.5,55.27 93.47,53.24 89.41,53.24 88.6,52.43 88.6,48.77 87.38,47.55 77.62,47.55 74.37,44.3 71.12,44.3 65.02,50.39 62.59,50.39 57.71,45.52 52.02,45.52 49.17,48.36 47.96,48.36 45.11,45.52 41.45,45.52 39.83,43.89 36.17,43.89 34.54,45.52 34.54,65.43 38.2,69.09 47.14,69.09 49.58,71.53 49.58,80.56 -1.63,80.56 -2.03,65.84 -2.03,-1.63 13.82,-1.63 15.04,-0.41 15.04,6.5 16.26,7.72 16.26,15.04 17.07,15.85 19.51,15.85 20.73,17.07 20.73,25.2 21.54,26.01 27.64,26.01 28.45,25.2 28.45,16.26 27.23,15.04 27.23,-0.41 28.45,-1.63
GND_ISO
  Top 0.508: IC10.5 24.39,17.08 22.35,15.04 22.35,5.23 CLKOUT.5
  pour Top: 26.01,-0.41 26.01,15.04 27.64,16.66 27.64,24.79 27.23,25.2 21.95,25.2 21.54,24.79 21.54,17.07 19.1,14.63 17.88,14.63 17.07,13.82 17.07,7.32 15.85,6.1 15.85,-0.41
HOLD_COM  (via drill 0.35)
  Top 0.203: IC7.22 92.29,41.08 90.22,39.01 v90.22,36.17 | v58.93,37.39 58.93,38.2 59.33,38.61 60.55,38.61 60.96,38.2 60.96,37.42 IC12.67 | 73.4,35.11 v74.37,34.14
  Top 0.254: R10.2 73.4,35.11
  Bottom 0.203: v90.22,36.17 90.22,35.66 89.51,34.95 89.51,30.58 88.59,29.67 75.39,29.67 74.78,30.28 74.78,33.73 v74.37,34.14 72.85,35.66 61.06,35.66 60.15,36.58 59.74,36.58 v58.93,37.39
IO0_ANALOG
  Top 0.406: R24.2 C59.2 R17.1
IO0_DIR  (via drill 0.35)
  Top 0.203: IC17.1 26.96,64.35 27.23,64.62 30.89,64.62 31.54,63.97 IC18.1 32.07,63.03 32.92,62.18 32.92,60.96 33.33,60.55 33.33,57.71 32.51,56.9 R18.2 31.7,56.73 v31.7,41.05 | IC12.80 62.08,41.45 58.52,41.45 v58.12,41.05
  Bottom 0.203: v58.12,41.05 57.71,40.64 32.11,40.64 v31.7,41.05
IO0_UC  (via drill 0.35)
  Top 0.203: IC18.2 30.89,63.8 30.48,64.21 29.67,64.21 v29.26,63.8 | v23.57,63.4 23.57,62.59 23.98,62.18 24.38,62.18 25.06,61.5 IC17.4 24.38,60.2 24.38,57.3 24.79,56.9 R19.2 25.36,31.74 arc90 v25.4,31.7 | v51.21,26.01 51.21,30.58 IC12.46
  Bottom 0.203: v29.26,63.8 23.98,63.8 v23.57,63.4 | v25.4,31.7 25.4,26.62 26.01,26.01 v51.21,26.01
IO1_DIR  (via drill 0.35)
  Top 0.203: IC19.1 17.21,64.35 17.48,64.62 21.13,64.62 21.78,63.97 IC20.1 22.32,63.03 23.16,62.18 23.16,60.96 23.57,60.55 23.57,57.71 22.76,56.9 R20.2 21.95,56.73 v21.95,41.05 | IC12.81 63.39,43.48 61.77,41.86 57.71,41.86 v57.3,41.45
  Bottom 0.203: v57.3,41.45 56.9,41.05 32.92,41.05 32.11,41.86 30.89,41.86 29.67,40.64 22.35,40.64 v21.95,41.05
IO1_UC  (via drill 0.35)
  Top 0.203: IC20.2 21.13,63.8 20.73,64.21 19.91,64.21 v19.51,63.8 | v13.82,63.4 13.82,62.59 14.22,62.18 14.63,62.18 15.31,61.5 IC19.4 14.63,60.2 14.63,57.3 15.04,56.9 R21.2 15.61,39.26 v15.65,39.01 | IC12.76 63.28,39.83 v59.33,39.83
  Bottom 0.203: v19.51,63.8 14.22,63.8 v13.82,63.4 | v59.33,39.83 16.46,39.83 v15.65,39.01
IO2_DIR  (via drill 0.35)
  Top 0.203: IC21.1 7.45,64.35 7.72,64.62 11.38,64.62 12.03,63.97 IC22.1 12.56,63.03 13.41,62.18 13.41,60.96 13.82,60.55 13.82,57.71 13.01,56.9 R22.2 11.99,56.86 v11.99,41.35 | IC12.82 61.48,42.27 56.49,42.27 v56.08,41.86
  Bottom 0.203: v56.08,41.86 55.68,41.45 33.12,41.45 32.31,42.27 30.68,42.27 29.46,41.05 23.16,41.05 22.35,41.86 21.54,41.86 20.42,40.74 12.6,40.74 v11.99,41.35
IO2_UC  (via drill 0.35)
  Top 0.203: IC22.2 11.38,63.8 10.97,64.21 9.75,64.21 v9.35,63.8 | v4.06,63.4 4.06,62.59 4.47,62.18 4.88,62.18 5.55,61.5 IC21.4 4.88,60.2 4.88,57.3 5.28,56.9 R23.2 5.85,40.88 v5.89,40.84 | IC12.77 63.39,40.64 63.39,40.63 62.99,40.23 60.15,40.23 v59.74,40.64
  Bottom 0.203: v9.35,63.8 4.47,63.8 v4.06,63.4 | v59.74,40.64 58.93,40.64 58.52,40.23 6.5,40.23 v5.89,40.84
LED_CLOCKIN
  Top 0.203: IC12.60 59.9,33.58 67.87,25.6 74.94,25.6 R40.1
LED_CLOCKOUT
  Top 0.203: IC12.58 67.23,24.79 67.87,24.79 68.44,24.22 R36.1
LED_EXPANSION
  Top 0.203: IC12.57 64.37,26.94 R35.1
LED_IO0
  Top 0.203: IC12.59 67.53,25.2 71.28,25.2 R39.1
LED_IO1
  Top 0.203: IC12.61 68.13,26.01 78.6,26.01 R43.1
LED_IO2
  Top 0.203: IC12.62 68.43,26.42 86.32,26.42 R49.1
LED_POWER
  Top 0.203: IC12.65 62.43,34.54 63.8,34.54 71.53,26.82 89.98,26.82 R50.1
MASTER_CTS  (via drill 0.35)
  Top 0.203: IC2.4 113.11,37.11 112.57,36.58 99.16,36.58 v97.94,35.36 | v71.53,34.14 67.87,37.8 66.25,37.8 IC12.75
  Bottom 0.203: v71.53,34.14 71.53,29.06 72.14,28.45 97.94,28.45 98.35,28.85 98.35,34.95 v97.94,35.36
MASTER_RTS  (via drill 0.35)
  Top 0.203: IC2.12 119.46,50.77 v119.48,50.8 | v70.71,33.33 70.31,32.92 68.3,32.92 IC12.71
  Bottom 0.203: v119.48,50.8 115.82,47.14 99.77,47.14 98.75,46.13 98.75,28.65 98.15,28.04 71.93,28.04 71.12,28.85 71.12,32.92 v70.71,33.33
MASTER_RXD  (via drill 0.35)
  Top 0.203: IC2.2 110.57,37.52 110.13,37.08 99.87,37.08 v99.57,37.39 | v52.43,27.64 52.02,28.04 52.02,29.98 IC12.48
  Bottom 0.203: v99.57,37.39 99.16,36.98 99.16,28.45 98.35,27.64 v52.43,27.64
MASTER_TXD  (via drill 0.35)
  Top 0.203: IC2.14 116.92,46.76 v116.94,46.74 | v52.02,26.42 51.61,26.82 51.61,30.28 IC12.47
  Bottom 0.203: v116.94,46.74 99.97,46.74 99.16,45.92 99.16,39.01 100.38,37.8 100.38,36.98 99.57,36.17 99.57,28.25 98.55,27.23 53.24,27.23 52.43,26.42 v52.02,26.42
N$2
  Top 0.406: IC10.6 26.14,19.38 26.82,18.69 26.82,17.07 24.3,14.55 CLKOUT.4
N$3
  Top 0.305: R35.2 65.67,21.83 T2.1
N$4  (via drill 0.35)
  Top 0.406: R37.1 64.37,14.77 v64.41,14.73
  Bottom 0.406: v64.41,14.73 73.9,14.73 LED0.C2
N$5
  Top 0.508: CLKOUT.1 17.27,5.08 18.69,6.5 18.69,13.41 21.95,16.66 21.95,21.13 22.76,21.95 23.57,21.95 | 23.57,21.95 24.37,21.95 IC10.8 arc-90 24.32,21.99 | C28.1 22.82,23.51 23.57,22.76 23.57,21.95
N$6
  Top 0.203: IC18.4 30.2,61.37 29.26,61.37 28.45,62.18 26.42,62.18 26.01,62.59 IC17.2 26.01,64.21 25.2,65.02 23.98,65.02 23.16,65.84 R29.1 20.73,66.21 R26.1
N$8
  Top 0.305: T2.3 65.02,18.69 65.67,18.04 R37.2
N$9
  Top 0.203: BNC2.1 43.78,67.96 30.57,67.96 28.45,65.84 26.01,65.84 24.14,67.71 R29.2
  Top 0.406: 43.78,67.96 43.89,67.35 R32.2
N$10
  Top 0.203: IC20.4 20.45,61.37 19.51,61.37 18.69,62.18 16.66,62.18 16.26,62.59 IC19.2 16.26,64.62 17.07,65.43 R30.1 14.63,66.21 R27.1
N$11
  Top 0.203: R30.2 17.07,69.49 17.48,69.9 25.13,69.9 BNC3.1
N$12
  Top 0.203: IC22.4 10.69,61.37 9.75,61.37 8.94,62.18 6.91,62.18 6.5,62.59 IC21.2 6.5,64.62 6.91,65.02 7.32,65.02 7.72,65.43 R31.1 5.28,66.21 R28.1
N$13
  Top 0.203: R31.2 7.72,67.87 10.28,67.87 BNC4.1
N$14
  Top 0.305: R36.2 69.74,21.83 T3.1
N$15
  Top 0.305: R43.2 81.93,21.83 T6.1
N$16
  Top 0.305: T3.3 69.09,18.69 69.74,18.04 R38.2
N$17
  Top 0.305: R39.2 73.8,21.83 T4.1
N$18
  Top 0.406: R52.1 92.82,16.5 93.47,15.85 94.28,15.85 95.1,15.04 95.1,8 LED3.C1
N$19
  Top 0.305: T4.3 73.15,18.69 73.8,18.04 R41.2
N$20
  Top 0.305: R40.2 77.87,21.83 T5.1
N$21
  Top 0.305: T6.3 81.28,18.69 81.93,18.04 R46.2
N$22
  Top 0.305: T5.3 77.22,18.69 77.87,18.04 R42.2
N$23
  Top 0.406: R51.1 88.76,16.5 91.03,14.22 91.03,12.19 91.85,11.38 93.24,11.38 LED3.C2
N$24
  Top 0.305: R44.2 85.99,21.83 T7.1
N$25
  Top 0.305: T7.3 85.34,18.69 85.99,18.04 R47.2
N$26
  Top 0.305: R49.2 90.06,21.83 T8.1
N$27
  Top 0.305: T8.3 89.41,18.69 90.06,18.04 R51.2
N$28
  Top 0.305: R50.2 94.12,21.83 T9.1
N$29
  Top 0.305: T9.3 93.47,18.69 94.12,18.04 R52.2
N$30  (via drill 0.35)
  Top 0.406: R41.1 72.5,16.42 v72.34,16.26
  Bottom 0.406: v72.34,16.26 78.84,16.26 80.06,15.04 80.06,12.6 81.28,11.38 82.58,11.38 LED1.C2
N$31
  Top 0.406: R46.1 80.63,16.5 81.28,15.85 83.44,15.85 LED2.C2
N$32
  Top 0.406: R42.1 76.57,16.5 77.22,15.85 79.25,15.85 80.06,15.04 80.06,8.82 LED1.C1
N$33  (via drill 0.35)
  Top 0.406: R47.1 84.69,16.42 v84.53,16.26
  Bottom 0.406: v84.53,16.26 84.53,6.91 85.34,6.1 87.86,6.1 LED2.C1
N$34
  Top 0.203: TEST.2 69.3,9.15 69.9,9.75 71.12,9.75 71.93,10.57 R45.1
N$35
  Top 0.61: R25.1 C60.1 39.18,55.64 39.62,56.08 40.23,56.08 40.78,56.63 IC23.5
N$36
  Top 0.406: R38.1 68.44,16.09 69.49,15.04 73.56,15.04 74.37,14.22 74.37,9.18 LED0.C1
N$37
  Top 0.508: IC13.2 83.3,65.2 R13.2
  Top 0.61: IC13.6 74.95,66.47 76.22,65.2 IC13.2
N$38
  Top 0.305: C7.1 107.78,61.04 IC3.17
N$39
  Top 0.508: R12.1 R11.1 80.47,67.06 79.88,66.47 IC13.3
N$40
  Top 0.305: USB.P$2 113.79,72.69 113.79,70.71 114.34,70.17 IC1.P$1
N$41
  Top 0.203: R8.1 5.95,20.83 R7.2
  Top 0.508: R7.2 8.8,16.52 8.13,15.85 5.28,15.85 4.47,15.04 4.47,5.17 CLKIN.1
N$42  (via drill 0.35)
  Top 0.508: IC11.5 5.28,27.09 arc-90 C27.1 4.88,27.09 v4.88,26.01 | R7.1 10.1,16.72 v10.16,16.66
  Power 0.508: v10.16,16.66 10.16,24.38 8.53,26.01 v4.88,26.01
N$43
  Top 0.406: R3.2 14.77,14.94 R4.2 14.83,18.04 14.83,18.9 14.57,19.16 IC8.4 18.62,20.58 IC10.2
N$44
  Top 0.305: IC16.2 86.88,60.05 87.38,60.55 88.15,60.55 C49.1
  Top 0.406: IC14.5 90.41,62.77 89.81,62.18 89.81,60.96 89.41,60.55 88.23,60.55 C49.1
N$45
  Top 0.508: R13.1 83.35,66.45 84.23,66.45 84.63,66.04 84.63,65.63 85.08,65.19 C44.1 R14.2
N$46
  Top 0.305: 89.41,66.04 89.41,64.21 89,63.8 86.97,63.8 86.56,63.4 86.56,60.96 86.16,60.55 IC16.3 83.31,60.55 82.91,60.15 82.91,59.33 82.09,58.52 80.17,58.52 U1.1 | 89.41,66.04 89.41,66.49 | 89.41,66.04 89.1,66.34 89.71,66.34 89.41,66.04
  Top 0.508: R14.1 89.41,66.49 C45.1
N$48
  Top 0.61: IC15.2 55.85,62.36 57.12,63.63 IC15.6 57.12,68.1 57.71,68.68 59.38,68.68 BNC1.1
N$49
  Top 0.254: IC16.1 85.02,59.01 84.53,58.52 83.82,58.52 83.41,58.12 83.41,57.44 C47.1
  Top 0.508: C47.1 84.19,57.34 84.63,56.9 84.63,56.19 84.94,55.88 85.71,55.88 C46.1
  Top 0.61: R16.1 C46.1
N$50
  Top 0.305: USB.P$3 112.98,70.71 112.44,70.17 IC1.P$3
N$51
  Top 0.61: IC15.3 57.12,59.11 58.12,58.12 61.37,58.12 64.21,60.96 68.24,60.96 U1.5
N$52
  Top 0.508: SENSOR_ANA.3 79.64,72.19 R11.2
N$55
  Top 0.203: T1.1 69.76,40.17 71.12,38.81 71.12,38.45 R15.2
N$57
  Top 0.508: T1.3 70.71,43.32 D1.A 74.03,49.11 69.9,53.24 67.87,53.24 67.17,52.54 U1.8
N$58
  Top 0.406: R24.1 40.93,59.98 IC23.1 40.78,59.06 40.23,58.52 39.32,58.52 38.88,58.08 IC23.4
N$59
  Top 0.508: C1.1 119.85,73.45 USB.SHIELD_4
N$61
  Top 0.508: R1.1 119.86,78.75 USB.SHIELD_1
N$64
  Top 0.203: R34.2 R32.1
  Top 0.406: R32.1 R33.2 C61.2 38.2,61.77 38.88,61.1 IC23.3
OSC1
  Top 0.305: IC12.92 60.5,48.36 61.37,48.36 61.74,47.99 OSC2.P$3
OSC2
  Top 0.305: IC7.37 80.34,38.68 OSC1.P$3
PDI-CLK  (via drill 0.35)
  Top 0.203: IC7.35 84.07,40.28 v84.12,40.23
  Bottom 0.203: v84.12,40.23 84.12,41.45 84.94,42.27 93.78,42.27 94.69,43.18 94.69,46.94 95.71,47.95 97.54,47.95 98.04,48.46 99.36,48.46 99.97,49.07 99.97,54.2 PDI1.5
PDI-DATA  (via drill 0.35)
  Top 0.203: IC7.34 82.09,41.23 v82.09,42.67
  Bottom 0.203: v82.09,42.67 93.47,42.67 94.28,43.48 94.28,47.14 95.5,48.36 97.28,48.36 PDI1.1
PDI_CLK  (via drill 0.35)
  Top 0.203: IC12.90 59.07,45.52 v58.12,45.52
  Bottom 0.203: v58.12,45.52 57.71,45.11 40.34,45.11 39.12,43.89 31.19,43.89 30.48,44.6 30.48,48.21 PDI.5
PDI_DATA  (via drill 0.35)
  Top 0.203: IC12.89 60.53,46.3 v58.93,44.7
  Bottom 0.203: v58.93,44.7 40.64,44.7 39.42,43.48 28.45,43.48 27.64,44.3 27.64,52.83 28.14,53.34 PDI.1
REF2.048V
  Top 0.305: IC12.5 52.42,48.78 50.39,50.8 49.58,50.8 48.77,49.99 47.55,49.99 47.14,50.39 47.14,51.79 IC6.6
RELAY  (via drill 0.35)
  Top 0.203: IC12.78 62.99,40.95 v62.59,40.95 | v68.68,38.2 R15.1
  Bottom 0.203: v62.59,40.95 65.33,38.2 v68.68,38.2
STATE  (via drill 0.35)
  Top 0.203: IC12.1 54.76,49.28 54.76,35.05 55.27,34.54 55.27,30.07 54.46,29.26 54.46,23.98 55.27,23.16 v57.71,23.16 | v84.63,25.5 84.63,24.04 R44.1
  Bottom 0.203: v57.71,23.16 82.3,23.16 v84.63,25.5
SYNCIN
  Top 0.203: IC9.2 7.62,21.23 6.91,21.95 4.47,21.95 4.06,21.54 4.06,20.89 R8.2
  Top 0.406: IC9.2 9.04,21.23 9.25,21.03 9.25,19.91 9.75,19.41 10.67,19.41 11.8,18.27 CLKIN.4 11.8,9.73 12.44,9.1 R6.2
USBDM
  Top 0.305: C6.1 117.04,66.65 114.2,66.65 114.2,66.05 IC1.P$6
  Top 0.406: IC3.16 112.39,61.69 arc90 114.3,63.6 114.3,65.88 arc-90 IC1.P$6
USBDP
  Top 0.305: C4.1 110.13,66.65 112.57,66.65 112.57,66.05 IC1.P$4 | 109.73,62.37 IC3.15
  Top 0.406: IC3.15 arc-90 109.8,62.38 111.15,62.38 arc90 112.44,63.67 IC1.P$4
USER_INPUT  (via drill 0.35)
  Top 0.203: R45.2 C62.1 R48.1 64.96,13.25 v64.92,13.21 | v50.39,42.27 50.39,42.34 IC12.17
  Top 0.305: v55.68,25.6 v55.68,28.85
  Ground 0.203: v55.68,36.98 v50.39,42.27
  Bottom 0.203: v64.92,13.21 57.1,13.21 55.68,14.63
  Bottom 0.305: 55.68,14.63 v55.68,25.6 | v55.68,28.85 v55.68,36.98
VCC  (via drill 0.35)
  Top 0.203: R48.2 66.18,11.89 v64.92,11.89 | IC16.9 IC16.10
  Top 0.254: R10.1 v73.15,37.49 | v77.11,35.15 76.04,35.15 R9.1
  Top 0.305: IC12.83 63.52,45.01 65.33,45.01 C30.1 | 78.49,59.55 C51.1 80.78,59.54 IC16.10 | IC12.44 50.17,30.96 C37.1 50.15,29.77 v49.38,29.77 | IC12.34 46.69,34.55 C38.1 v47.55,33.02 | IC12.24 44.34,43.44 C39.1 42.88,43.79 v42.16,43.79 | IC12.14 48.52,46.33 47.45,46.33 47.09,46.68 C40.1 v46.13,45.92 | IC12.74 66.7,36.64 C32.1 67.31,36.43 v67.77,36.88 | v60.15,28.35 59.49,29 C36.1 59.49,29.7 IC12.54 | IC12.64 63.29,32.97 C34.1 64.11,33.02 64.11,33.53 63.8,33.83 v63.5,33.83
  Top 0.406: IC9.5 10.1,24.18 C25.1 9.9,24.53 v10.57,25.2 | IC8.5 14.57,24.18 C23.1 arc-90 14.73,24.42 v14.73,25.6 | IC10.1 18.35,21.92 C24.1 arc-90 18.29,24.45 v18.29,25.6 | v8.13,58.12 7.32,58.93 C56.1 7.15,60.58 IC21.5 | v17.88,58.12 17.07,58.93 C54.1 16.91,60.58 IC19.5 | v27.64,58.12 26.82,58.93 C52.1 26.66,60.58 IC17.5 | OSC2.P$4 64.38,46.63 66.95,46.63 67.31,46.38 C29.1 67.31,46.38 v66.75,45.82 | v65.53,43.69 65.53,44.51 C30.1 | IC3.4 119.81,55.84 arc90 C9.1 | OSC1.P$4 79.08,42.04 C18.1 79.08,44.74 79.35,45.01 v80.06,45.01 | IC7.39 80.97,37.08 80.47,36.58 80.47,36.17 80.06,35.76 79.49,35.76 C21.1 79.45,34.85 v79.96,34.34 | IC7.9 90.39,28.78 C20.1 91.24,28.75 v91.85,29.36 | v97.54,38.71 97.47,38.65 C19.1 96.08,38.68 IC7.19 | IC7.31 85.59,44.16 84.84,44.91 84.84,45.58 C22.1 84.84,45.66 v84.84,46.63 | C2.1 108.06,50.56 v108.51,51 | 78.49,59.55 78.49,58.98 77.22,57.71 76.4,57.71 73.15,54.46 73.15,53.24 75.18,51.21 77.62,51.21 79.55,49.28 v79.55,47.04
  Top 0.559: SENSOR_DIG.4 95.31,72.96 v94.28,71.93
  Top 0.61: IC2.20 107.95,48.92 107.29,49.58 C2.1 | C9.1 120.86,55.92 121.51,55.27 121.51,52.83 120.9,52.22 v119.89,52.22 | IC4.5 101.46,30.79 C14.1 101.76,31.09 C16.1 101.76,33.47 101.7,33.53 v101.7,35.87
  Power 1.016: v94.28,71.93 99.57,71.93 100.79,70.71 100.79,49.17 99.16,47.55 98.6,47.55 PDI1.2
  other vias: 101.7,34.24 101.7,35.05
  pour Power: 126.39,57.3 119.48,57.3 118.67,56.49 118.67,52.43 117.86,51.61 95.91,51.61 91.85,47.55 77.62,47.55 74.37,44.3 71.12,44.3 65.02,50.39 62.59,50.39 57.71,45.52 52.02,45.52 49.17,48.36 47.96,48.36 45.11,45.52 41.45,45.52 39.83,43.89 36.17,43.89 34.54,45.52 34.54,65.02 33.73,65.84 -1.63,65.84 -2.03,65.43 -2.03,-1.63 13.82,-1.63 15.04,-0.41 15.04,6.5 16.26,7.72 16.26,15.04 17.07,15.85 19.51,15.85 20.73,17.07 20.73,25.2 21.54,26.01 27.64,26.01 28.45,25.2 28.45,16.26 27.23,15.04 27.23,-0.41 28.45,-1.63 126.39,-1.63
VDD  (via drill 0.35)
  Top 0.203: v45.11,65.43 45.35,65.43 R34.1 | C43.1 90.67,57.1 v91.75,57.1 | v93.57,57.1 93.61,57.16 IC14.3
  Top 0.305: IC12.4 51.56,50.36 C35.1 | IC12.94 59.74,49.01 59.74,49.58 58.93,50.39 58.93,50.8 59.28,51.15 C33.1
  Top 0.406: C35.1 51,51.71 51,52.22 52.18,53.4 55.06,53.4 C31.1 | C31.1 v55.27,52.43 | C31.1 55.48,53.4 59.17,53.4 59.74,52.83 59.74,51.72 C33.1
  Top 0.508: IC14.1 91.25,59.96 90.63,59.33 C43.1 90.59,57.1 v89.61,57.1 | SENSOR_ANA.4 78.84,73.25 v77.72,72.14
  Top 0.61: v80.87,54.46 v80.87,53.65 C17.1 81.44,51.86 82.94,50.36 C15.1 arc90 83.41,50.26 IC5.5 | IC6.2 41.6,48.05 C13.1 39.13,46.48 C12.+ 38.63,46.15 38,45.52 v36.98,45.52 | R25.2 40.44,52.38 v40.44,51.21 | v47.95,65.43 48.77,64.62 C50.1 51.01,64.45 C48.1 53.2,64.66 54.05,63.8 55.27,63.8 55.85,64.39 IC15.7 | IC13.7 69.71,65.2 arc90 C41.1 arc90 69.29,65.19 C42.1 66.69,65.23 v65.53,65.23 | R16.2 v88.19,58.32
  Bottom 0.203: v91.75,57.1 v93.57,57.1
  other vias: 80.87,52.83
  pour Power: 87.78,49.58 86.97,48.77 77.62,48.77 73.96,45.11 71.53,45.11 65.43,51.21 62.59,51.21 57.71,46.33 52.43,46.33 49.17,49.58 47.96,49.58 44.7,46.33 41.05,46.33 39.42,44.7 36.58,44.7 35.36,45.92 35.36,65.02 36.17,65.84 47.14,65.84 51.21,69.9 51.21,80.56 87.38,80.56 88.19,79.75 88.19,69.9 89,69.09 93.88,69.09 94.69,68.28 94.69,55.68 93.47,54.46 88.6,54.46 87.78,53.64

## Text on the board
tPlace: V1.1
Measures: jack / 3.5mm | jack / 3.5mm | USB / Mini | DC / power
tDocu: 19 mm | Change log: / - R29, R30, R31 to 0603